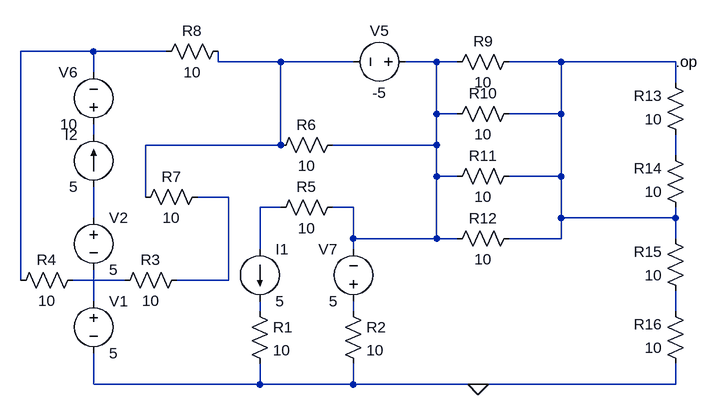
[diagram p0: schematic FinalTest_VSource_CSource_R.asc]
FinalTest_VSource_CSource_R.asc, the LTspice schematic file:
Version 4
SHEET 1 880 680
WIRE -64 -160 -176 -160
WIRE 48 -160 -64 -160
WIRE 128 -144 128 -160
WIRE 224 -144 128 -144
WIRE 336 -144 224 -144
WIRE 464 -144 416 -144
WIRE 496 -144 464 -144
WIRE 656 -144 576 -144
WIRE 832 -144 656 -144
WIRE -64 -128 -64 -160
WIRE 832 -112 832 -144
WIRE 464 -64 464 -144
WIRE 496 -64 464 -64
WIRE 656 -64 656 -144
WIRE 656 -64 576 -64
WIRE -64 -32 -64 -48
WIRE 224 -16 224 -144
WIRE 224 -16 16 -16
WIRE 464 -16 464 -64
WIRE 464 -16 304 -16
WIRE 832 0 832 -32
WIRE 464 32 464 -16
WIRE 496 32 464 32
WIRE 656 32 656 -64
WIRE 656 32 576 32
WIRE 16 64 16 -16
WIRE 144 64 96 64
WIRE 224 80 192 80
WIRE 336 80 304 80
WIRE -64 96 -64 48
WIRE 656 96 656 32
WIRE 832 96 832 80
WIRE 832 96 656 96
WIRE 336 128 336 80
WIRE 464 128 464 32
WIRE 464 128 336 128
WIRE 496 128 464 128
WIRE 656 128 656 96
WIRE 656 128 576 128
WIRE 832 128 832 96
WIRE 192 144 192 80
WIRE 336 144 336 128
WIRE -176 192 -176 -160
WIRE -16 192 -96 192
WIRE 144 192 144 64
WIRE 144 192 64 192
WIRE -64 224 -64 176
WIRE 192 240 192 224
WIRE 336 240 336 224
WIRE 832 240 832 208
WIRE -64 352 -64 304
WIRE 192 352 192 320
WIRE 192 352 -64 352
WIRE 336 352 336 320
WIRE 336 352 192 352
WIRE 528 352 336 352
WIRE 832 352 832 320
WIRE 832 352 528 352
FLAG 528 352 0
SYMBOL voltage -64 208 R0
SYMATTR InstName V1
SYMATTR Value 5
SYMBOL voltage -64 80 R0
SYMATTR InstName V2
SYMATTR Value 5
SYMBOL voltage 432 -144 R90
WINDOW 0 -32 56 VBottom 2
WINDOW 3 32 56 VTop 2
SYMATTR InstName V5
SYMATTR Value -5
SYMBOL voltage -64 -32 R180
WINDOW 0 24 96 Left 2
WINDOW 3 24 16 Left 2
SYMATTR InstName V6
SYMATTR Value 10
SYMBOL voltage 336 240 R180
WINDOW 0 24 96 Left 2
WINDOW 3 24 16 Left 2
SYMATTR InstName V7
SYMATTR Value 5
SYMBOL res 176 224 R0
SYMATTR InstName R1
SYMATTR Value 10
SYMBOL res 320 224 R0
SYMATTR InstName R2
SYMATTR Value 10
SYMBOL res 80 176 R90
WINDOW 0 0 56 VBottom 2
WINDOW 3 32 56 VTop 2
SYMATTR InstName R3
SYMATTR Value 10
SYMBOL res -80 176 R90
WINDOW 0 0 56 VBottom 2
WINDOW 3 32 56 VTop 2
SYMATTR InstName R4
SYMATTR Value 10
SYMBOL res 320 64 R90
WINDOW 0 0 56 VBottom 2
WINDOW 3 32 56 VTop 2
SYMATTR InstName R5
SYMATTR Value 10
SYMBOL res 320 -32 R90
WINDOW 0 0 56 VBottom 2
WINDOW 3 32 56 VTop 2
SYMATTR InstName R6
SYMATTR Value 10
SYMBOL res 112 48 R90
WINDOW 0 0 56 VBottom 2
WINDOW 3 32 56 VTop 2
SYMATTR InstName R7
SYMATTR Value 10
SYMBOL res 144 -176 R90
WINDOW 0 0 56 VBottom 2
WINDOW 3 32 56 VTop 2
SYMATTR InstName R8
SYMATTR Value 10
SYMBOL res 592 -160 R90
WINDOW 0 0 56 VBottom 2
WINDOW 3 32 56 VTop 2
SYMATTR InstName R9
SYMATTR Value 10
SYMBOL res 592 -80 R90
WINDOW 0 0 56 VBottom 2
WINDOW 3 32 56 VTop 2
SYMATTR InstName R10
SYMATTR Value 10
SYMBOL res 592 16 R90
WINDOW 0 0 56 VBottom 2
WINDOW 3 32 56 VTop 2
SYMATTR InstName R11
SYMATTR Value 10
SYMBOL res 592 112 R90
WINDOW 0 0 56 VBottom 2
WINDOW 3 32 56 VTop 2
SYMATTR InstName R12
SYMATTR Value 10
SYMBOL res 848 -16 R180
WINDOW 0 36 76 Left 2
WINDOW 3 36 40 Left 2
SYMATTR InstName R13
SYMATTR Value 10
SYMBOL res 848 96 R180
WINDOW 0 36 76 Left 2
WINDOW 3 36 40 Left 2
SYMATTR InstName R14
SYMATTR Value 10
SYMBOL res 848 224 R180
WINDOW 0 36 76 Left 2
WINDOW 3 36 40 Left 2
SYMATTR InstName R15
SYMATTR Value 10
SYMBOL res 848 336 R180
WINDOW 0 36 76 Left 2
WINDOW 3 36 40 Left 2
SYMATTR InstName R16
SYMATTR Value 10
SYMBOL current 192 144 R0
SYMATTR InstName I1
SYMATTR Value 5
SYMBOL current -64 48 R180
WINDOW 0 24 80 Left 2
WINDOW 3 24 0 Left 2
SYMATTR InstName I2
SYMATTR Value 5
TEXT 832 -144 Left 2 !.op

The netlist it stands for:
* FinalTest_VSource_CSource_R.asc
V1 N011 0 5
V2 N009 N011 5
V5 N003 N002 -5
V6 N005 N001 10
V7 N013 N003 5
R1 N012 0 10
R2 N013 0 10
R3 N007 N010 10
R4 N010 N001 10
R5 N003 N008 10
R6 N003 N002 10
R7 N007 N002 10
R8 N002 N001 10
R9 N004 N003 10
R10 N004 N003 10
R11 N004 N003 10
R12 N004 N003 10
R13 N006 N004 10
R14 N004 N006 10
R15 N014 N004 10
R16 0 N014 10
I1 N008 N012 5
I2 N009 N005 5
.op
.backanno
.end